# Altium project Temp_meter_16CH.PrjPcb
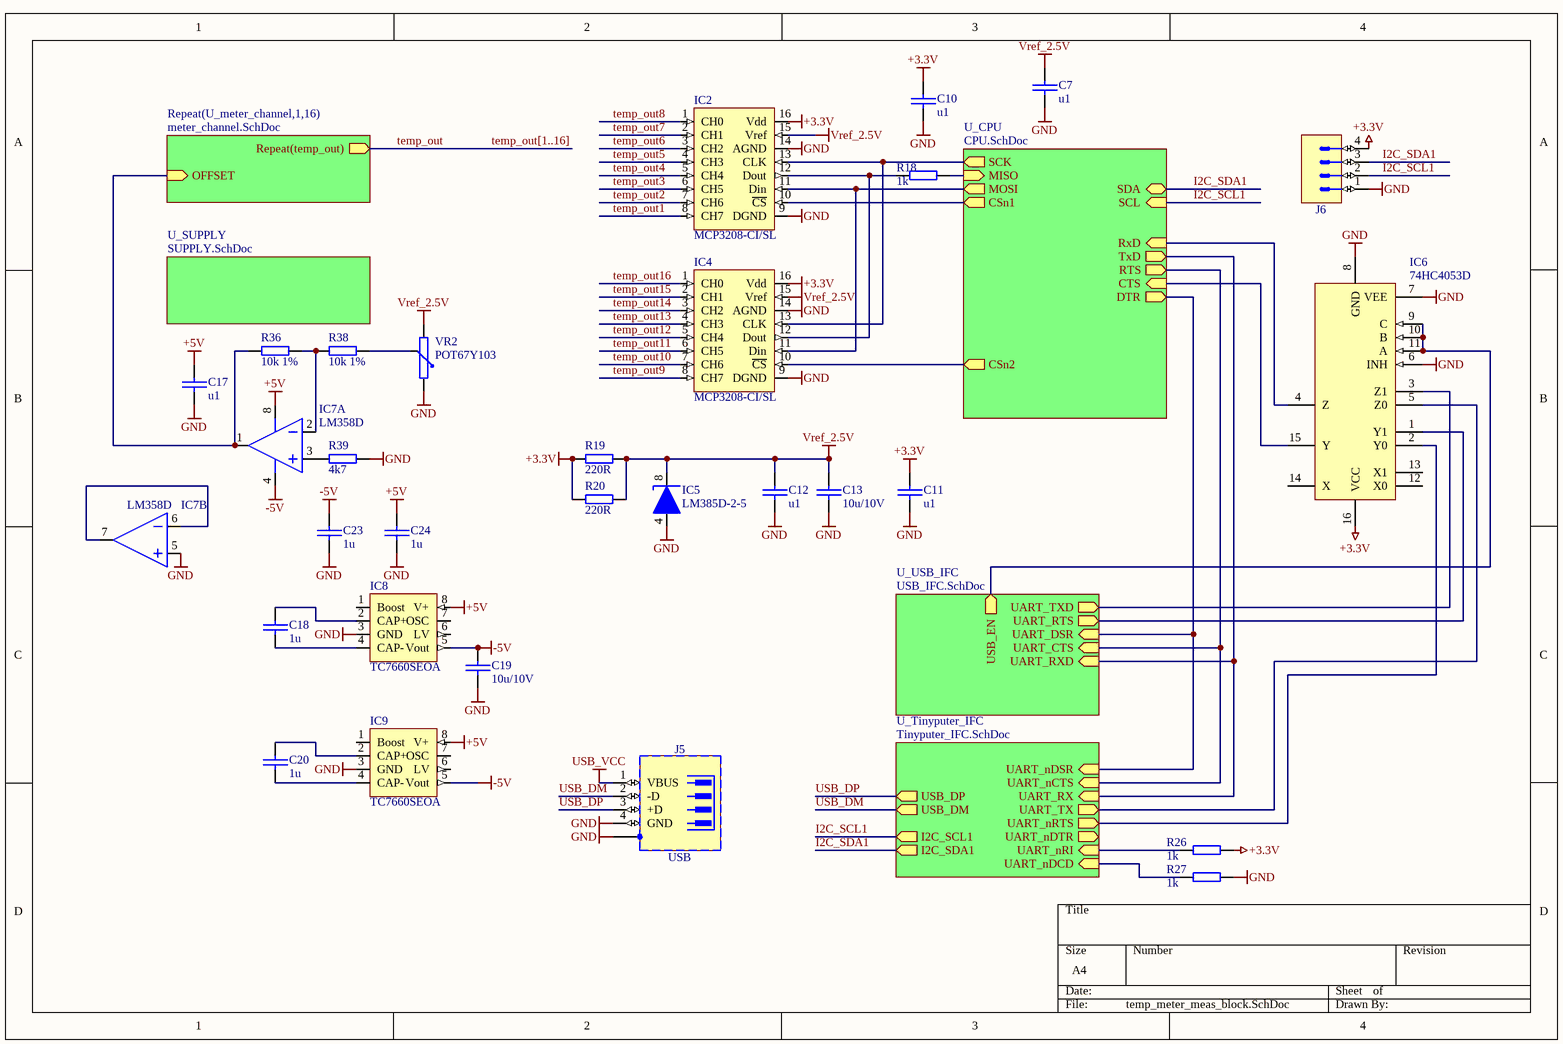
[diagram p0: temp_meter_meas_block.SchDoc]
6 sheets, 521 parts. Net scope: hierarchical (ports join the sheet entries above them; power ports are global).
Board file: Temp_meter_16CH.PcbDoc
Sheets:
  temp_meter_meas_block.SchDoc
    U_meter_channel1 = meter_channel.SchDoc
    U_meter_channel2 = meter_channel.SchDoc
    U_meter_channel3 = meter_channel.SchDoc
    U_meter_channel4 = meter_channel.SchDoc
    U_meter_channel5 = meter_channel.SchDoc
    U_meter_channel6 = meter_channel.SchDoc
    U_meter_channel7 = meter_channel.SchDoc
    U_meter_channel8 = meter_channel.SchDoc
    U_meter_channel9 = meter_channel.SchDoc
    U_meter_channel10 = meter_channel.SchDoc
    U_meter_channel11 = meter_channel.SchDoc
    U_meter_channel12 = meter_channel.SchDoc
    U_meter_channel13 = meter_channel.SchDoc
    U_meter_channel14 = meter_channel.SchDoc
    U_meter_channel15 = meter_channel.SchDoc
    U_meter_channel16 = meter_channel.SchDoc
    U_CPU = CPU.SchDoc
    U_SUPPLY = SUPPLY.SchDoc
    U_USB_IFC = USB_IFC.SchDoc
    U_Tinyputer_IFC = Tinyputer_IFC.SchDoc

## Sheet temp_meter_meas_block.SchDoc
size A4

### Parts
C7  u1  [0402C]
C10  u1  [0603C]
C11  u1  [0603C]
C12  u1  [0603C]
C13  10u/10V  [0805C]
C17  u1  [0603C]
C18  1u  [0603C]
C19  10u/10V  [0805C]
C20  1u  [0603C]
C23  1u  [0603C]
C24  1u  [0603C]
IC2  MCP3208-CI/SL  [SO-16]
IC4  MCP3208-CI/SL  [SO-16]
IC5  LM385D-2-5  [SO-8]
IC6  74HC4053D  [SO-16]
IC7  LM358D  [SO-8]  (parts A,B of 2)
IC8  TC7660SEOA  [SO-8]
IC9  TC7660SEOA  [SO-8]
J5  USB  [FCI_87520-0010BLF]
J6  KK®  [MOLEX_22-27-2041]  (value not drawn)
R18  1k  [0603R]
R19  220R  [0805]
R20  220R  [0805]
R26  1k  [0603R]
R27  1k  [0603R]
R36  10k 1%  [0603R]
R38  10k 1%  [0603R]
R39  4k7  [0603R]
VR2  POT67Y103  [trimpot1]

### Sub-sheets
Repeat(U_meter_channel,1,16) = meter_channel.SchDoc: Repeat(temp_out) (out), OFFSET (in)
U_CPU = CPU.SchDoc: SDA (bidir), SCL (in), CTS (in), RxD (in), TxD (out), RTS (out), DTR (out), SCK (out), MISO (in), MOSI (out), CSn1 (out), CSn2 (out)
U_SUPPLY = SUPPLY.SchDoc: no entries
U_Tinyputer_IFC = Tinyputer_IFC.SchDoc: UART_nCTS (in), UART_nDSR (in), UART_RX (in), UART_nRTS (out), UART_nDTR (out), UART_TX (out), UART_nDCD (in), UART_nRI (in), USB_DP (out), USB_DM (out), I2C_SCL1 (out), I2C_SDA1 (out)
U_USB_IFC = USB_IFC.SchDoc: UART_TXD (out), UART_RXD (in), UART_RTS (out), UART_CTS (in), UART_DSR (in), USB_EN (out)

### Nets
+3.3V: C10.1 C11.1 IC2.16(Vdd) IC4.16(Vdd) IC6.16(VCC) J6.4 R19.2 R20.2 R26.2
+5V: C17.1 C24.1 IC7.8(V+) IC8.8(V+) IC9.8(V+)
-5V: C19.1 C23.1 IC7.4(V-) IC8.5(Vout) IC9.5(Vout)
GND: C7.2 C10.2 C11.2 C12.2 C13.2 C17.2 C19.2 C23.2 C24.2 IC2.9(DGND) IC2.14(AGND) IC4.9(DGND) IC4.14(AGND) IC5.4(A) IC6.6(INH) IC6.7(VEE) IC6.8(GND) IC7.5(IN+) IC8.3(GND) IC9.3(GND) J5.4(GND) J5.5(SH) J6.1 R27.2 R39.2 VR2.3(U)
USB_VCC: J5.1(VBUS)
Vref_2.5V: C7.1 C12.1 C13.1 IC2.15(Vref) IC4.15(Vref) IC5.8(C) R19.1 R20.1 VR2.1(D)
CSn1: IC2.10(~{CS}) ; sheet U_CPU/CSn1
CSn2: IC4.10(~{CS}) ; sheet U_CPU/CSn2
CTS: IC6.15(Y) ; sheet U_CPU/CTS
I2C_SCL1: J6.2 ; sheet U_CPU/SCL, sheet U_Tinyputer_IFC/I2C_SCL1
I2C_SDA1: J6.3 ; sheet U_CPU/SDA, sheet U_Tinyputer_IFC/I2C_SDA1
MISO: R18.2 ; sheet U_CPU/MISO
MOSI: IC2.11(Din) IC4.11(Din) ; sheet U_CPU/MOSI
OFFSET: IC7.1(OUT) R36.1 ; sheet Repeat(U_meter_channel,1,16)/OFFSET
PROG_TxD: sheet U_CPU/TxD, sheet U_USB_IFC/UART_RXD, sheet U_Tinyputer_IFC/UART_RX
RxD: IC6.4(Z) ; sheet U_CPU/RxD
SCK: IC2.13(CLK) IC4.13(CLK) ; sheet U_CPU/SCK
temp_out: sheet Repeat(U_meter_channel,1,16)/Repeat(temp_out)
temp_out1: IC2.8(CH7)
temp_out2: IC2.7(CH6)
temp_out3: IC2.6(CH5)
temp_out4: IC2.5(CH4)
temp_out5: IC2.4(CH3)
temp_out6: IC2.3(CH2)
temp_out7: IC2.2(CH1)
temp_out8: IC2.1(CH0)
temp_out9: IC4.8(CH7)
temp_out10: IC4.7(CH6)
temp_out11: IC4.6(CH5)
temp_out12: IC4.5(CH4)
temp_out13: IC4.4(CH3)
temp_out14: IC4.3(CH2)
temp_out15: IC4.2(CH1)
temp_out16: IC4.1(CH0)
UART_nCTS: sheet U_CPU/RTS, sheet U_USB_IFC/UART_CTS, sheet U_Tinyputer_IFC/UART_nCTS
UART_nDCD: R27.1 ; sheet U_Tinyputer_IFC/UART_nDCD
UART_nDSR: sheet U_CPU/DTR, sheet U_USB_IFC/UART_DSR, sheet U_Tinyputer_IFC/UART_nDSR
UART_nRI: R26.1 ; sheet U_Tinyputer_IFC/UART_nRI
UART_nRTS: IC6.2(Y0) ; sheet U_Tinyputer_IFC/UART_nRTS
UART_RTS: IC6.1(Y1) ; sheet U_USB_IFC/UART_RTS
UART_TX: IC6.5(Z0) ; sheet U_Tinyputer_IFC/UART_TX
UART_TXD: IC6.3(Z1) ; sheet U_USB_IFC/UART_TXD
USB_DM: J5.2(-D) ; sheet U_Tinyputer_IFC/USB_DM
USB_DP: J5.3(+D) ; sheet U_Tinyputer_IFC/USB_DP
USB_EN: IC6.9(C) IC6.10(B) IC6.11(A) ; sheet U_USB_IFC/USB_EN
NetC18_1: C18.1 IC8.2(CAP+)
NetC18_2: C18.2 IC8.4(CAP-)
NetC20_1: C20.1 IC9.2(CAP+)
NetC20_2: C20.2 IC9.4(CAP-)
NetIC2_12: IC2.12(Dout) IC4.12(Dout) R18.1
NetIC7_2: IC7.2(IN-) R36.2 R38.1
NetIC7_3: IC7.3(IN+) R39.1
NetIC7_6: IC7.6(IN-) IC7.7(OUT)
NetR38_2: R38.2 VR2.2(W)

Not connected (* = marked no-connect by the designer): IC6 12(X0) 13(X1) 14(X); IC8 1(Boost) 6(LV) 7(OSC); IC9 1(Boost) 6(LV) 7(OSC)

### Buses and harness runs
bus temp_out[1..16]

### Library data of the parts
C7 C10-C12 C17 C18 C20 C23 C24 = CAP_SMD_0402: Capacitor SMD
C13 C19 = CAP_SMD_0805: Capacitor SMD
IC2 IC4 = ADC_MCP3208: 8-Channel 12-Bit A/D with SPI
IC5 = REF_LM285/385: 1.2V micropower voltage reference
IC6 = 4053
IC7 = OA_LM358: Operational Amplifier
IC8 IC9 = PWM_TC7660: 20mA PUMP DC-TO-DC VOLTAGE CONVERTER
J5 = FCI_87520-0010BLF: 4 Pin + 1 Shield USB Receptacle; Part Description: USB 2.0 Type A Receptacle, 4 Pins, Right Angle, Shielded; Manufacturer: FCI; Part Number: FCI_87520-0010BLF; Component Kind: Standard; Component Type: Standard; Pin Count: 6; Family: USB; Mounted: Yes; Socket: No; SMD: No; Status: None; Manufacturer Part Number: 87520-0010BLF; ComponentHeight: 7.7mm; HelpURL: \\cern.ch\dfs\Applications\Altium\Datasheets\FCI_87520-0010BLF.pdf; Author: CERN DEM JMW; CreateDate: 2008-10-06; LatestRevisionDate: 2008-10-06; Table: FCI
J6 = MOLEX_22-27-2041: Connector 4 Male; Part Description: 2.54mm (.100") Pitch KK® Wire-to-Board Header, Vertical, with Friction Lock, 4 Circuits, Tin (Sn) Plating; Manufacturer: MOLEX; Part Number: MOLEX_22-27-2041; Component Kind: Standard; Component Type: Standard; Pin Count: 4; Family: KK®; Mounted: Yes; Socket: No; SMD: No; Manufacturer Part Number: 22-27-2041; ComponentHeight: 11.7mm; HelpURL: \\cern.ch\dfs\Applications\Altium\Datasheets\MOLEX_22-27-2041.pdf; Author: CERN DEM JLC; CreateDate: 2008-12-04; LatestRevisionDate: 2008-12-04; Table: MOLEX
R18 R26 R27 R36 R38 R39 = RES_0603: SMD Resistor
R19 R20 = RES2: Resistor
VR2 = TRIMPOT_PREC_9mm_Y: Precision trimpot, 0.5W, +/- 10%

## Sheet meter_channel.SchDoc
size A4
Used 16 times, as channels U_meter_channel1, U_meter_channel2, U_meter_channel3, U_meter_channel4, U_meter_channel5, U_meter_channel6, U_meter_channel7, U_meter_channel8, U_meter_channel9, U_meter_channel10, U_meter_channel11, U_meter_channel12, U_meter_channel13, U_meter_channel14, U_meter_channel15, U_meter_channel16. Parts and nets are listed once, with the designators drawn on the sheet.
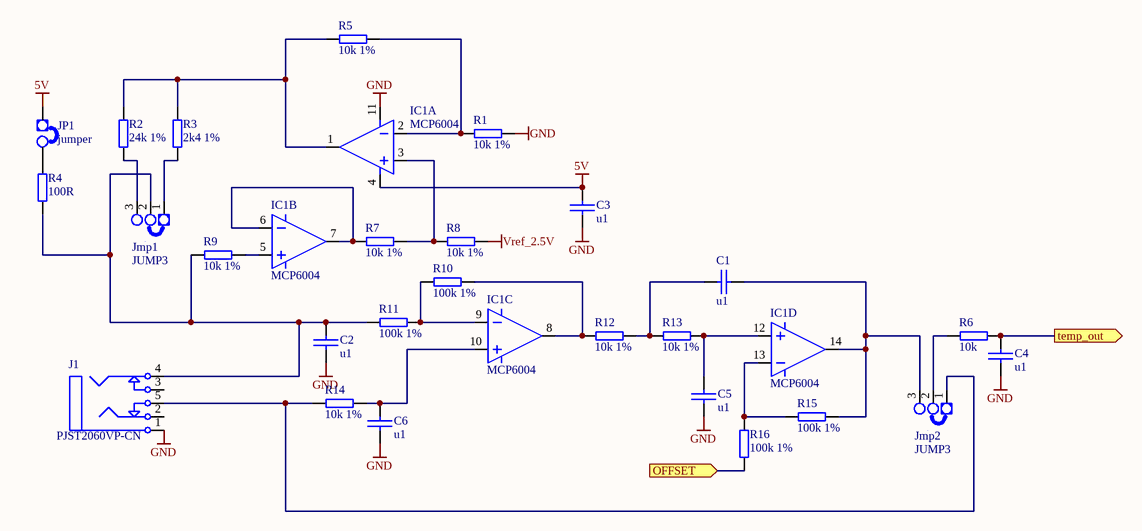
[diagram p1: meter_channel.SchDoc]

### Parts
C1  u1  [0603C]
C2  u1  [0603C]
C3  u1  [0603C]
C4  u1  [0603C]
C5  u1  [0603C]
C6  u1  [0603C]
IC1  MCP6004  [TSSOP14-4.4]  (parts A,B,C,D of 4)
J1  PJST2060VP-CN  [ST-3150-5N]
Jmp1  JUMP3  [jump3]
Jmp2  JUMP3  [jump3]
JP1  jumper  [jump]
R1  10k 1%  [0603R]
R2  24k 1%  [0603R]
R3  2k4 1%  [0603R]
R4  100R  [0603R]
R5  10k 1%  [0603R]
R6  10k  [0603R]
R7  10k 1%  [0603R]
R8  10k 1%  [0603R]
R9  10k 1%  [0603R]
R10  100k 1%  [0603R]
R11  100k 1%  [0603R]
R12  10k 1%  [0603R]
R13  10k 1%  [0603R]
R14  10k 1%  [0603R]
R15  100k 1%  [0603R]
R16  100k 1%  [0603R]

### Ports
OFFSET (in), temp_out (out)

### Nets
5V: C3.1 IC1.4 JP1.1(E1)
GND: C2.2 C3.2 C4.1 C5.1 C6.2 IC1.11 J1.1 R1.1
Vref_2.5V: R8.2
OFFSET: R16.1 ; port OFFSET
temp_out: C4.2 R6.1 ; port temp_out
NetC1_1: C1.1 R12.2 R13.1
NetC1_2: C1.2 IC1.14 Jmp2.3 R15.2
NetC2_1: C2.1 J1.4 Jmp1.2 R4.2 R9.1 R11.1
NetC5_2: C5.2 IC1.12 R13.2
NetC6_1: C6.1 IC1.10 R14.2
NetIC1_1: IC1.1 R2.1 R3.1 R5.2
NetIC1_2: IC1.2 R1.2 R5.1
NetIC1_3: IC1.3 R7.2 R8.1
NetIC1_5: IC1.5 R9.2
NetIC1_6: IC1.6 IC1.7 R7.1
NetIC1_8: IC1.8 R10.2 R12.1
NetIC1_9: IC1.9 R10.1 R11.2
NetIC1_13: IC1.13 R15.1 R16.2
NetJ1_5: J1.5 Jmp2.1 R14.1
NetJmp1_1: Jmp1.1 R3.2
NetJmp1_3: Jmp1.3 R2.2
NetJmp2_2: Jmp2.2 R6.2
NetJP1_2: JP1.2(E2) R4.1

Not connected (* = marked no-connect by the designer): J1 2 3

### Channels
U_meter_channel1: designators end in A; ports OFFSET=OFFSET temp_out=temp_out1
U_meter_channel2: designators end in B; ports OFFSET=OFFSET temp_out=temp_out2
U_meter_channel3: designators end in C; ports OFFSET=OFFSET temp_out=temp_out3
U_meter_channel4: designators end in D; ports OFFSET=OFFSET temp_out=temp_out4
U_meter_channel5: designators end in E; ports OFFSET=OFFSET temp_out=temp_out5
U_meter_channel6: designators end in F; ports OFFSET=OFFSET temp_out=temp_out6
U_meter_channel7: designators end in G; ports OFFSET=OFFSET temp_out=temp_out7
U_meter_channel8: designators end in H; ports OFFSET=OFFSET temp_out=temp_out8
U_meter_channel9: designators end in I; ports OFFSET=OFFSET temp_out=temp_out9
U_meter_channel10: designators end in J; ports OFFSET=OFFSET temp_out=temp_out10
U_meter_channel11: designators end in K; ports OFFSET=OFFSET temp_out=temp_out11
U_meter_channel12: designators end in L; ports OFFSET=OFFSET temp_out=temp_out12
U_meter_channel13: designators end in M; ports OFFSET=OFFSET temp_out=temp_out13
U_meter_channel14: designators end in N; ports OFFSET=OFFSET temp_out=temp_out14
U_meter_channel15: designators end in O; ports OFFSET=OFFSET temp_out=temp_out15
U_meter_channel16: designators end in P; ports OFFSET=OFFSET temp_out=temp_out16

### Library data of the parts
C1-C6 = CAP_SMD: Capacitor SMD
IC1 = OA_MCP6004: micropower opamp
J1 = CON_Phonejack Stereo SW: 3-Conductor Jack with 2 break contacts (normals) and 2 auxiliary make contacts; Revision 1: 17-Jul-2002: Re-released for DXP Platform.; Revision 2: 17-Dec-2003: PCB Footprint replaced.; Published: 5-Jan-2004; Datasheet: Latest Revision: 07-Mar-2000; Publisher: Altium Limited
R1-R16 = RES2: Resistor

## Sheet CPU.SchDoc
size A4
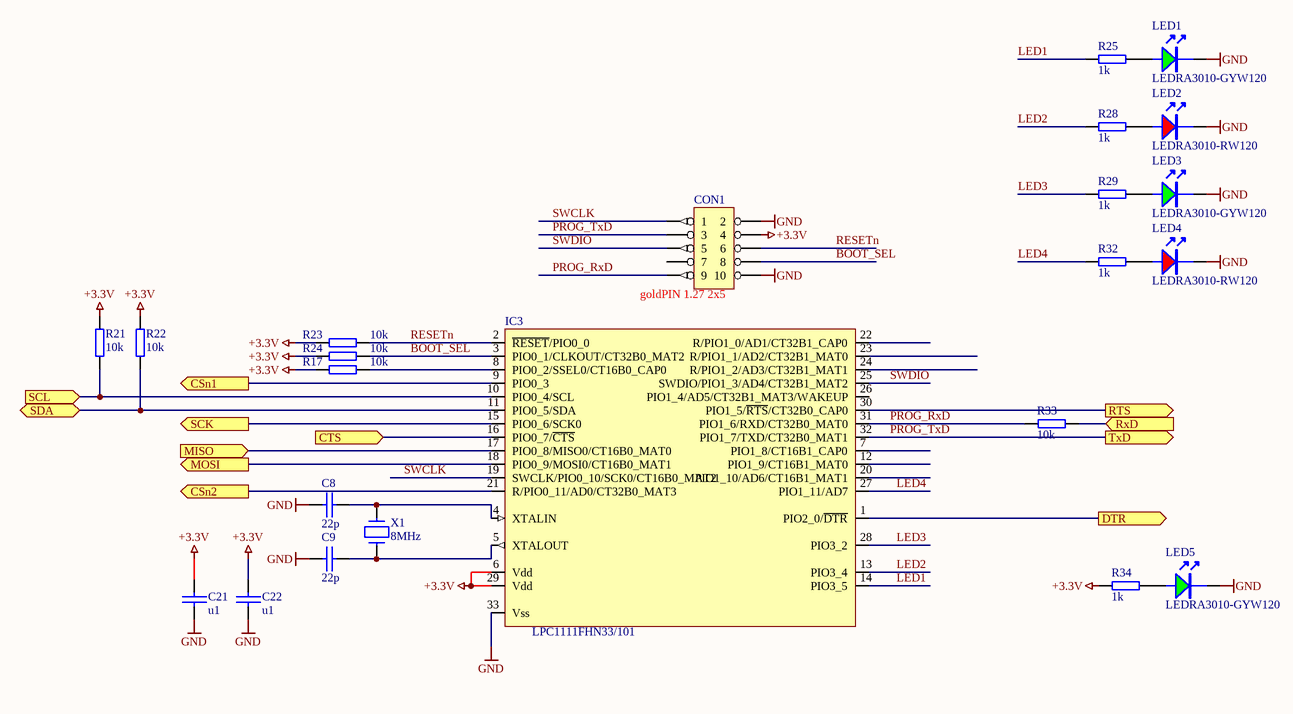
[diagram p2: CPU.SchDoc]

### Parts
C8  22p  [0603C]
C9  22p  [0603C]
C21  u1  [0603]
C22  u1  [0603]
CON1  goldPIN 1.27 2x5  [CON_2x5_MINI]
IC3  LPC1111FHN33/101  [HVQFN33_QFN127P600-8N]
LED1  LEDRA3010-GYW120  [LED_KPA3010_G]
LED2  LEDRA3010-RW120  [LED_KPA3010_R]
LED3  LEDRA3010-GYW120  [LED_KPA3010_G]
LED4  LEDRA3010-RW120  [LED_KPA3010_R]
LED5  LEDRA3010-GYW120  [LED_KPA3010_G]
R17  10k  [0603r]
R21  10k  [0603R]
R22  10k  [0603R]
R23  10k  [0603r]
R24  10k  [0603r]
R25  1k  [0603r]
R28  1k  [0603r]
R29  1k  [0603r]
R32  1k  [0603r]
R33  10k  [0603r]
R34  1k  [0603r]
X1  8MHz  [HC-49SM]

### Ports
CSn1 (out), CSn2 (out), CTS (in), DTR (out), MISO (in), MOSI (out), RTS (out), RxD (in), SCK (out), SCL (in), SDA (bidir), TxD (out)

### Nets
+3.3V: C21.1 C22.1 CON1.4 IC3.6(Vdd) IC3.29(Vdd) R17.2 R21.2 R22.2 R23.2 R24.2 R34.1
GND: C8.1 C9.1 C21.2 C22.2 CON1.2 CON1.10 IC3.33(Vss) LED1.K LED2.K LED3.K LED4.K LED5.K
BOOT_SEL: CON1.8 IC3.3(PIO0_1/CLKOUT/CT32B0_MAT2) R24.1
CSn1: IC3.9(PIO0_3) ; port CSn1
CSn2: IC3.21(R/PIO0_11/AD0/CT32B0_MAT3) ; port CSn2
CTS: IC3.16(PIO0_7/~{CTS}) ; port CTS
I2C_SCL1: IC3.10(PIO0_4/SCL) R21.1 ; port SCL
I2C_SDA1: IC3.11(PIO0_5/SDA) R22.1 ; port SDA
LED1: IC3.14(PIO3_5) R25.1
LED2: IC3.13(PIO3_4) R28.1
LED3: IC3.28(PIO3_2) R29.1
LED4: IC3.27(PIO1_11/AD7) R32.1
MISO: IC3.17(PIO0_8/MISO0/CT16B0_MAT0) ; port MISO
MOSI: IC3.18(PIO0_9/MOSI0/CT16B0_MAT1) ; port MOSI
PROG_RxD: CON1.9 IC3.31(PIO1_6/RXD/CT32B0_MAT0) R33.1
PROG_TxD: CON1.3 IC3.32(PIO1_7/TXD/CT32B0_MAT1) ; port TxD
RESETn: CON1.6 IC3.2(~{RESET}/PIO0_0) R23.1
RxD: R33.2 ; port RxD
SCK: IC3.15(PIO0_6/SCK0) ; port SCK
SWCLK: CON1.1 IC3.19(SWCLK/PIO0_10/SCK0/CT16B0_MAT2)
SWDIO: CON1.5 IC3.25(SWDIO/PIO1_3/AD4/CT32B1_MAT2)
UART_nCTS: IC3.30(PIO1_5/~{RTS}/CT32B0_CAP0) ; port RTS
UART_nDSR: IC3.1(PIO2_0/~{DTR}) ; port DTR
NetC8_2: C8.2 IC3.4(XTALIN) X1.2
NetC9_2: C9.2 IC3.5(XTALOUT) X1.1
NetIC3_8: IC3.8(PIO0_2/SSEL0/CT16B0_CAP0) R17.1
NetLED1_A: LED1.A R25.2
NetLED2_A: LED2.A R28.2
NetLED3_A: LED3.A R29.2
NetLED4_A: LED4.A R32.2
NetLED5_A: LED5.A R34.2

Not connected (* = marked no-connect by the designer): CON1 7; IC3 7(PIO1_8/CT16B1_CAP0) 12(PIO1_9/CT16B1_MAT0) 20(PIO1_10/AD6/CT16B1_MAT1) 22(R/PIO1_0/AD1/CT32B1_CAP0) 23(R/PIO1_1/AD2/CT32B1_MAT0) 24(R/PIO1_2/AD3/CT32B1_MAT1) 26(PIO1_4/AD5/CT32B1_MAT3/WAKEUP)

### Library data of the parts
C8 C9 = CAP_SMD_0603: Capacitor SMD
C21 C22 = CAP_SMD: Capacitor SMD
CON1 = HEADER 5X2
IC3 = UPC_LPC1111
LED1 LED3 LED5 = LED_SMD_90deg_G: LED (Maritex)
LED2 LED4 = LED_SMD_90deg_R: LED (Maritex)
R17 R23-R25 R28 R29 R32-R34 = RES_SMD: SMD Resistor
R21 R22 = RES_0603: SMD Resistor
X1 = X_CRYSTAL: Crystal oscillator

## Sheet SUPPLY.SchDoc
size A4
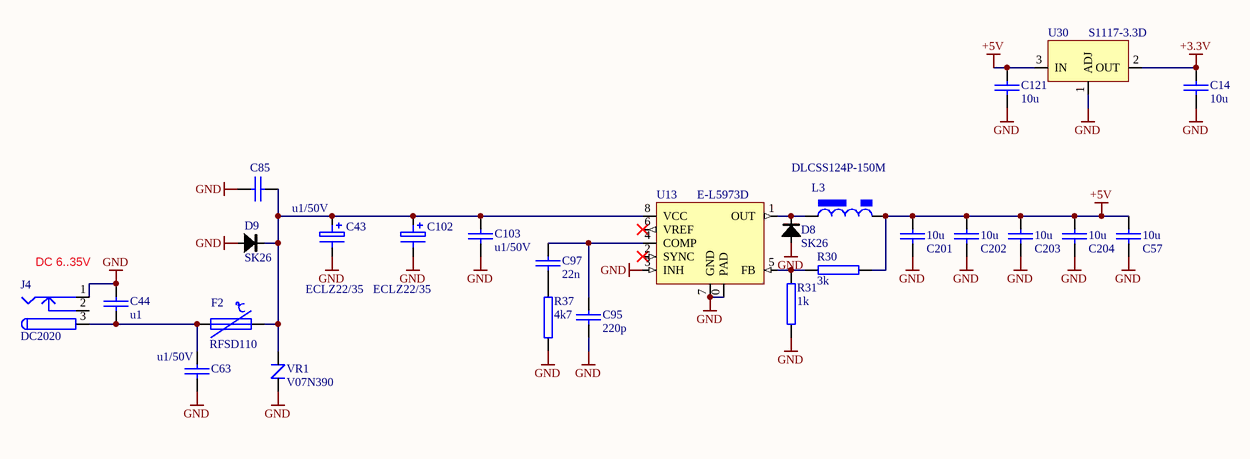
[diagram p3: SUPPLY.SchDoc]

### Parts
C14  10u  [0805]
C43  ECLZ22/35  [CAP_SMT_EL_6.3mm_D]
C44  u1  [0603]
C57  10u  [0805C]
C63  u1/50V  [0805C]
C85  u1/50V  [0805C]
C95  220p  [0603C]
C97  22n  [0603C]
C102  ECLZ22/35  [CAP_SMT_EL_6.3mm_D]
C103  u1/50V  [0805C]
C121  10u  [0805]
C201  10u  [0805C]
C202  10u  [0805C]
C203  10u  [0805C]
C204  10u  [0805C]
D8  SK26  [DO-214AA/SMB]
D9  SK26  [DO-214AA/SMB]
F2  RFSD110  [PTC_SMD_1812]
J4  DC2020  [DC2020]
L3  DLCSS124P-150M  [choke_DLCSS124]
R30  3k  [0603R]
R31  1k  [0603R]
R37  4k7  [0603R]
U13  E-L5973D  [PDSO-8]
U30  S1117-3.3D  [TO-252]
VR1  V07N390  [Varistor_7mm]

### Nets
+3.3V: C14.2 U30.2(OUT)
+5V: C57.1 C121.2 C201.1 C202.1 C203.1 C204.1 L3.2 R30.1 U30.3(IN)
GND: C14.1 C43.2 C44.1 C57.2 C63.2 C85.2 C95.1 C102.2 C103.2 C121.1 C201.2 C202.2 C203.2 C204.2 D8.A D9.A J4.1 R31.2 R37.1 U13.0(PAD) U13.3(INH) U13.7(GND) U30.1(ADJ) VR1.2
NetC43_1: C43.1 C85.1 C102.1 C103.1 D9.K F2.2 U13.8(VCC) VR1.1
NetC44_2: C44.2 C63.1 F2.1 J4.3
NetC95_2: C95.2 C97.2 U13.4(COMP)
NetC97_1: C97.1 R37.2
NetD8_K: D8.K L3.1 U13.1(OUT)
NetR30_2: R30.2 R31.1 U13.5(FB)

Not connected (* = marked no-connect by the designer): J4 2; U13 2(SYNC)* 6(VREF)*

### Notes on the sheet
- DC 6..35V

### Library data of the parts
C14 C44 C57 C63 C85 C95 C97 C103 C121 C201-C204 = CAP_SMD: Capacitor SMD
C43 C102 = CAP_ELECTRO_SMD: Electrolytic Capacitor
D8 D9 = DIODE_SK26: 2A shottky diode (Maritex)
F2 = F_POLYSWITCH: polymer FUSE
J4 = CON_DC_JACK_TH: Low Voltage Power Supply Connector (maritex); Published: 17-Dec-2003; Datasheet: Latest Revision: 09-May-2002; Publisher: Altium Limited
L3 = POWER_INDUCTOR_CSS124: inductor
R30 R31 R37 = RES_SMD: SMD Resistor
U13 = L5973D: 2.5A SWITCH STEP DOWN SWITCHING REGULATOR
U30 = REG_S1117-3.3D: Voltage Regulator
VR1 = Varistor V07N: varistor 7mm (Maritex)

## Sheet USB_IFC.SchDoc
size A4
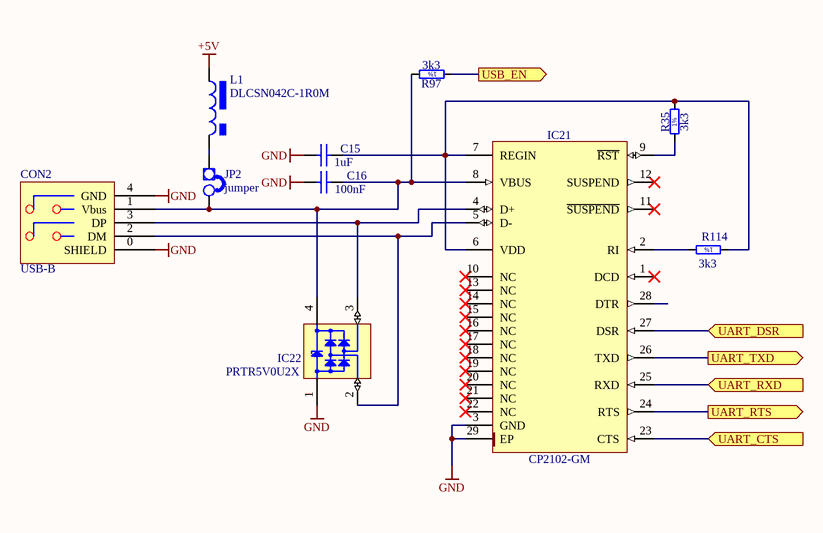
[diagram p4: USB_IFC.SchDoc]

### Parts
C15  1uF  [0603C]
C16  100nF  [0603C]
CON2  USB-B  [USBB-G]
IC21  CP2102-GM  [QFN50P500X500X100-29N-S335]
IC22  PRTR5V0U2X  [SOT190P230X110-4N]
JP2  jumper  [jump]
L1  DLCSN042C-1R0M  [L_DLCSN042C]
R35  3k3  [0603R]
R97  3k3  [0603R]
R114  3k3  [0603R]

### Ports
UART_CTS (in), UART_DSR (in), UART_RTS (out), UART_RXD (in), UART_TXD (out), USB_EN (out)

### Nets
+5V: L1.1
GND: C15.2 C16.2 CON2.0(SHIELD) CON2.4(GND) IC21.3(GND) IC21.29(EP) IC22.1(GND)
PROG_TxD: IC21.25(RXD) ; port UART_RXD
UART_nCTS: IC21.23(CTS) ; port UART_CTS
UART_nDSR: IC21.27(DSR) ; port UART_DSR
UART_RTS: IC21.24(RTS) ; port UART_RTS
UART_TXD: IC21.26(TXD) ; port UART_TXD
USB_EN: R97.1 ; port USB_EN
NetC15_1: C15.1 IC21.6(VDD) IC21.7(REGIN) R35.2 R114.1
NetC16_1: C16.1 CON2.1(Vbus) IC21.8(VBUS) IC22.4(VCC) JP2.2(E2) R97.2
NetCON2_2: CON2.2(DM) IC21.5(D-) IC22.2(I/O1)
NetCON2_3: CON2.3(DP) IC21.4(D+) IC22.3(I/O2)
NetIC21_2: IC21.2(RI) R114.2
NetIC21_9: IC21.9(~{RST}) R35.1
NetJP2_1: JP2.1(E1) L1.2

Not connected (* = marked no-connect by the designer): IC21 1(DCD)* 10(NC)* 11(~{SUSPEND})* 12(SUSPEND)* 13(NC)* 14(NC)* 15(NC)* 16(NC)* 17(NC)* 18(NC)* 19(NC)* 20(NC)* 21(NC)* 22(NC)* 28(DTR)

### Notes on the sheet
- (in symbol R0603_3K3_1%_0.1W_100PPM) 1%

### Library data of the parts
C15 = CC0603_1UF_16V_10%_X7R: Non-polarised capacitor; Part Description: SMD Multilayer Chip Ceramic Capacitor; Manufacturer: GENERIC; Manufacturer1 Part Number: 223824613663; Voltage: 16V; TC: X7R; Tolerance: ±10%; Table: Capacitors SMD; Part Number: CC0603_1UF_16V_10%_X7R; Component Kind: Standard; Component Type: Standard; Footprint: CAPC1608X87N; Pin Count: 2; Value: 1uF; Status: Preferred; Manufacturer Part Number: CC0603_1uF_16V_10%_X7R; Case: 0603; Mounted: Yes; Socket: No; SMD: Yes; Manufacturer1 Example: PHYCOMP; Manufacturer1 ComponentHeight: 0.87mm; HelpURL: \\cern.ch\dfs\Applications\Altium\Datasheets\CC0805_X5R_PHYCOMP_HC.pdf; Author: CERN DEM JLC; CreateDate: 12/3/2007; LatestRevisionDate: 12/3/2007
C16 = CC0603_100NF_50V_10%_X7R: Non-polarised capacitor; Part Description: SMD Multilayer Chip Ceramic Capacitor; Manufacturer: GENERIC; Manufacturer1 Part Number: 223858615649; Voltage: 50V; TC: X7R; Tolerance: ±10%; Table: Capacitors SMD; Part Number: CC0603_100NF_50V_10%_X7R; Component Kind: Standard; Component Type: Standard; Footprint: CAPC1608X87N; Pin Count: 2; Value: 100nF; Status: Preferred; Manufacturer Part Number: CC0603_100NF_50V_10%_X7R; Case: 0603; Mounted: Yes; Socket: No; SMD: Yes; Manufacturer1 Example: PHYCOMP; Manufacturer1 ComponentHeight: 0.87mm; HelpURL: \\cern.ch\dfs\Applications\Altium\Datasheets\CC0603_X7R_PHYCOMP.pdf; Author: CERN DEM JLC; CreateDate: 03/12/2007; LatestRevisionDate: 03/12/2007
CON2 = CON_USB_B: USB connector B type (TME)
IC21 = CP2102-GM: Single-Chip USB to UART Bridge; Manufacturer: SILICON LABS; Table: Analog & Interface; Part Number: CP2102-GM; Component Kind: Standard; Component Type: Standard; Device: CP2102-GM; PackageDescription: QFN, 0.50mm Pitch, Square; 28 pin, 5.00mm L X 5.00mm W X 1.00mm H body (w/thermal tab 3.35 X 3.35mm),  IPC Medium Density; Part Description: Single-Chip USB to UART Bridge; Manufacturer Part Number: CP2102-GM; Pin Count: 29; Case: QFN28; Mounted: Yes; Socket: No; SMD: Yes; ComponentHeight: 1.0mm; Author: CERN DEM JLC; HelpURL: \\cern.ch\dfs\Applications\Altium\Datasheets\CP2102-GM.pdf; CreateDate: 3/3/2011; LatestRevisionDate: 3/3/2011
IC22 = PRTR5V0U2X: Ultra Low Capacitance Double Rail-to-Rail ESD Protection Diode; Part Description: Ultra Low Capacitance (1pF) Double Rail-to-Rail ESD Protection Diode (8kV); Manufacturer: PHILIPS NXP; Voltage: 5.5V; Table: Diodes; Part Number: PRTR5V0U2X; Component Kind: Standard; Component Type: Standard; Device: PRTR5V0U2X; PackageDescription: SOT143B, SOT, 1.90mm Pitch; 4 Pin, 1.30mm W X 2.90mm L X 1.10mm H body, IPC Medium Density; Manufacturer Part Number: PRTR5V0U2X; Pin Count: 4; Case: SOT143B; Mounted: Yes; Socket: No; SMD: Yes; ComponentHeight: 1.1mm; HelpURL: \\cern.ch\dfs\Applications\Altium\Datasheets\PRTR5V0U2X.pdf; Author: CERN DEM JLC; CreateDate: 3/22/2011; LatestRevisionDate: 3/22/2011
L1 = L_POWER_DLCSN042C: inductor (Maritex)
R35 R97 R114 = R0603_3K3_1%_0.1W_100PPM: Resistor - 1%; Part Description: General Purpose Thick Film Chip Resistor; Manufacturer: GENERIC; Manufacturer1 Part Number: NRC06F3301TRF; Power: 0.1W; TC: ±100ppm/°C; Table: Resistors SMD; Part Number: R0603_3K3_1%_0.1W_100PPM; Component Kind: Standard; Component Type: Standard; Footprint: RESC1608X55N; Pin Count: 2; Value: 3k3; Status: Preferred; Tolerance: ±1%; Manufacturer Part Number: R0603_3K3_1%_0.1W_100PPM; Case: 0603; Mounted: Yes; Socket: No; SMD: Yes; Manufacturer1 Example: NIC COMPONENT; Manufacturer1 ComponentHeight: 0.55mm; HelpURL: \\cern.ch\dfs\Applications\Altium\Datasheets\R0603_NIC_NRC.pdf; Author: CERN DEM JLC; CreateDate: 12/3/2007; LatestRevisionDate: 3/13/2008

## Sheet Tinyputer_IFC.SchDoc
size A4
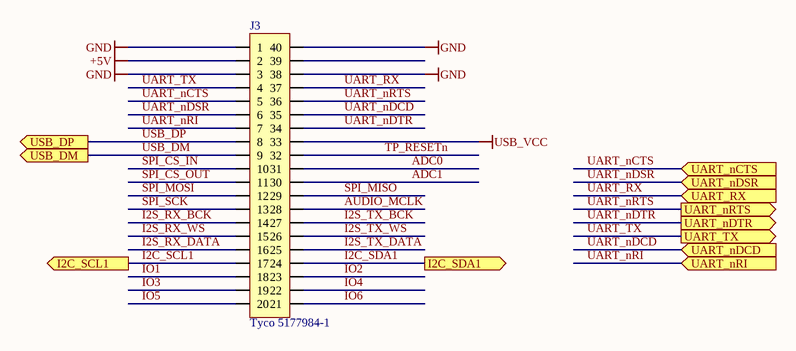
[diagram p5: Tinyputer_IFC.SchDoc]

### Parts
J3  Tyco 5177984-1  [TYCO_5177984-1]

### Ports
I2C_SCL1 (out), I2C_SDA1 (out), UART_nCTS (in), UART_nDCD (in), UART_nDSR (in), UART_nDTR (out), UART_nRI (in), UART_nRTS (out), UART_RX (in), UART_TX (out), USB_DM (out), USB_DP (out)

### Nets
+5V: J3.2
GND: J3.1 J3.3 J3.38 J3.40
USB_VCC: J3.33
ADC0: J3.31
ADC1: J3.30
AUDIO_MCLK: J3.28
I2C_SCL1: J3.17 ; port I2C_SCL1
I2C_SDA1: J3.24 ; port I2C_SDA1
I2S_RX_BCK: J3.14
I2S_RX_DATA: J3.16
I2S_RX_WS: J3.15
I2S_TX_BCK: J3.27
I2S_TX_DATA: J3.25
I2S_TX_WS: J3.26
IO1: J3.18
IO2: J3.23
IO3: J3.19
IO4: J3.22
IO5: J3.20
IO6: J3.21
SPI_CS_IN: J3.10
SPI_CS_OUT: J3.11
SPI_MISO: J3.29
SPI_MOSI: J3.12
SPI_SCK: J3.13
TP_RESETn: J3.32
UART_nCTS: J3.5 ; port UART_nCTS
UART_nDCD: J3.35 ; port UART_nDCD
UART_nDSR: J3.6 ; port UART_nDSR
UART_nDTR: J3.34 ; port UART_nDTR
UART_nRI: J3.7 ; port UART_nRI
UART_nRTS: J3.36 ; port UART_nRTS
UART_RX: J3.37 ; port UART_RX  [project net PROG_TxD]
UART_TX: J3.4 ; port UART_TX
USB_DM: J3.9 ; port USB_DM
USB_DP: J3.8 ; port USB_DP

Not connected (* = marked no-connect by the designer): J3 39

### Library data of the parts
J3 = CON_2x20_PLUG_0.8_Tyco: 0.8 mm dual row

## Nets that join several sheets
5V: U_meter_channel1 (C3A.1 IC1A.4 JP1A.1), U_meter_channel2 (C3B.1 IC1B.4 JP1B.1), U_meter_channel3 (C3C.1 IC1C.4 JP1C.1), U_meter_channel4 (C3D.1 IC1D.4 JP1D.1), U_meter_channel5 (C3E.1 IC1E.4 JP1E.1), U_meter_channel6 (C3F.1 IC1F.4 JP1F.1), U_meter_channel7 (C3G.1 IC1G.4 JP1G.1), U_meter_channel8 (C3H.1 IC1H.4 JP1H.1), U_meter_channel9 (C3I.1 IC1I.4 JP1I.1), U_meter_channel10 (C3J.1 IC1J.4 JP1J.1), U_meter_channel11 (C3K.1 IC1K.4 JP1K.1), U_meter_channel12 (C3L.1 IC1L.4 JP1L.1), U_meter_channel13 (C3M.1 IC1M.4 JP1M.1), U_meter_channel14 (C3N.1 IC1N.4 JP1N.1), U_meter_channel15 (C3O.1 IC1O.4 JP1O.1), U_meter_channel16 (C3P.1 IC1P.4 JP1P.1)
+3.3V: temp_meter_meas_block (9 pins), CPU (11 pins), SUPPLY (C14.2 U30.2)
+5V: temp_meter_meas_block (5 pins), SUPPLY (9 pins), USB_IFC (L1.1), Tinyputer_IFC (J3.2)
GND: temp_meter_meas_block (26 pins), U_meter_channel1 (8 pins), U_meter_channel2 (8 pins), U_meter_channel3 (8 pins), U_meter_channel4 (8 pins), U_meter_channel5 (8 pins), U_meter_channel6 (8 pins), U_meter_channel7 (8 pins), U_meter_channel8 (8 pins), U_meter_channel9 (8 pins), U_meter_channel10 (8 pins), U_meter_channel11 (8 pins), U_meter_channel12 (8 pins), U_meter_channel13 (8 pins), U_meter_channel14 (8 pins), U_meter_channel15 (8 pins), U_meter_channel16 (8 pins), CPU (12 pins), SUPPLY (24 pins), USB_IFC (7 pins), Tinyputer_IFC (J3.1 J3.3 J3.38 J3.40)
USB_VCC: temp_meter_meas_block (J5.1), Tinyputer_IFC (J3.33)
Vref_2.5V: temp_meter_meas_block (9 pins), U_meter_channel1 (R8A.2), U_meter_channel2 (R8B.2), U_meter_channel3 (R8C.2), U_meter_channel4 (R8D.2), U_meter_channel5 (R8E.2), U_meter_channel6 (R8F.2), U_meter_channel7 (R8G.2), U_meter_channel8 (R8H.2), U_meter_channel9 (R8I.2), U_meter_channel10 (R8J.2), U_meter_channel11 (R8K.2), U_meter_channel12 (R8L.2), U_meter_channel13 (R8M.2), U_meter_channel14 (R8N.2), U_meter_channel15 (R8O.2), U_meter_channel16 (R8P.2)
CSn1: temp_meter_meas_block (IC2.10), CPU (IC3.9)
CSn2: temp_meter_meas_block (IC4.10), CPU (IC3.21)
CTS: temp_meter_meas_block (IC6.15), CPU (IC3.16)
I2C_SCL1: temp_meter_meas_block (J6.2), CPU (IC3.10 R21.1), Tinyputer_IFC (J3.17)
I2C_SDA1: temp_meter_meas_block (J6.3), CPU (IC3.11 R22.1), Tinyputer_IFC (J3.24)
MISO: temp_meter_meas_block (R18.2), CPU (IC3.17)
MOSI: temp_meter_meas_block (IC2.11 IC4.11), CPU (IC3.18)
OFFSET: temp_meter_meas_block (IC7.1 R36.1), U_meter_channel1 (R16A.1), U_meter_channel2 (R16B.1), U_meter_channel3 (R16C.1), U_meter_channel4 (R16D.1), U_meter_channel5 (R16E.1), U_meter_channel6 (R16F.1), U_meter_channel7 (R16G.1), U_meter_channel8 (R16H.1), U_meter_channel9 (R16I.1), U_meter_channel10 (R16J.1), U_meter_channel11 (R16K.1), U_meter_channel12 (R16L.1), U_meter_channel13 (R16M.1), U_meter_channel14 (R16N.1), U_meter_channel15 (R16O.1), U_meter_channel16 (R16P.1)
PROG_TxD: CPU (CON1.3 IC3.32), USB_IFC (IC21.25), Tinyputer_IFC (J3.37)
RxD: temp_meter_meas_block (IC6.4), CPU (R33.2)
SCK: temp_meter_meas_block (IC2.13 IC4.13), CPU (IC3.15)
temp_out1: temp_meter_meas_block (IC2.8), U_meter_channel1 (C4A.2 R6A.1)
temp_out2: temp_meter_meas_block (IC2.7), U_meter_channel2 (C4B.2 R6B.1)
temp_out3: temp_meter_meas_block (IC2.6), U_meter_channel3 (C4C.2 R6C.1)
temp_out4: temp_meter_meas_block (IC2.5), U_meter_channel4 (C4D.2 R6D.1)
temp_out5: temp_meter_meas_block (IC2.4), U_meter_channel5 (C4E.2 R6E.1)
temp_out6: temp_meter_meas_block (IC2.3), U_meter_channel6 (C4F.2 R6F.1)
temp_out7: temp_meter_meas_block (IC2.2), U_meter_channel7 (C4G.2 R6G.1)
temp_out8: temp_meter_meas_block (IC2.1), U_meter_channel8 (C4H.2 R6H.1)
temp_out9: temp_meter_meas_block (IC4.8), U_meter_channel9 (C4I.2 R6I.1)
temp_out10: temp_meter_meas_block (IC4.7), U_meter_channel10 (C4J.2 R6J.1)
temp_out11: temp_meter_meas_block (IC4.6), U_meter_channel11 (C4K.2 R6K.1)
temp_out12: temp_meter_meas_block (IC4.5), U_meter_channel12 (C4L.2 R6L.1)
temp_out13: temp_meter_meas_block (IC4.4), U_meter_channel13 (C4M.2 R6M.1)
temp_out14: temp_meter_meas_block (IC4.3), U_meter_channel14 (C4N.2 R6N.1)
temp_out15: temp_meter_meas_block (IC4.2), U_meter_channel15 (C4O.2 R6O.1)
temp_out16: temp_meter_meas_block (IC4.1), U_meter_channel16 (C4P.2 R6P.1)
UART_nCTS: CPU (IC3.30), USB_IFC (IC21.23), Tinyputer_IFC (J3.5)
UART_nDCD: temp_meter_meas_block (R27.1), Tinyputer_IFC (J3.35)
UART_nDSR: CPU (IC3.1), USB_IFC (IC21.27), Tinyputer_IFC (J3.6)
UART_nRI: temp_meter_meas_block (R26.1), Tinyputer_IFC (J3.7)
UART_nRTS: temp_meter_meas_block (IC6.2), Tinyputer_IFC (J3.36)
UART_RTS: temp_meter_meas_block (IC6.1), USB_IFC (IC21.24)
UART_TX: temp_meter_meas_block (IC6.5), Tinyputer_IFC (J3.4)
UART_TXD: temp_meter_meas_block (IC6.3), USB_IFC (IC21.26)
USB_DM: temp_meter_meas_block (J5.2), Tinyputer_IFC (J3.9)
USB_DP: temp_meter_meas_block (J5.3), Tinyputer_IFC (J3.8)
USB_EN: temp_meter_meas_block (IC6.9 IC6.10 IC6.11), USB_IFC (R97.1)